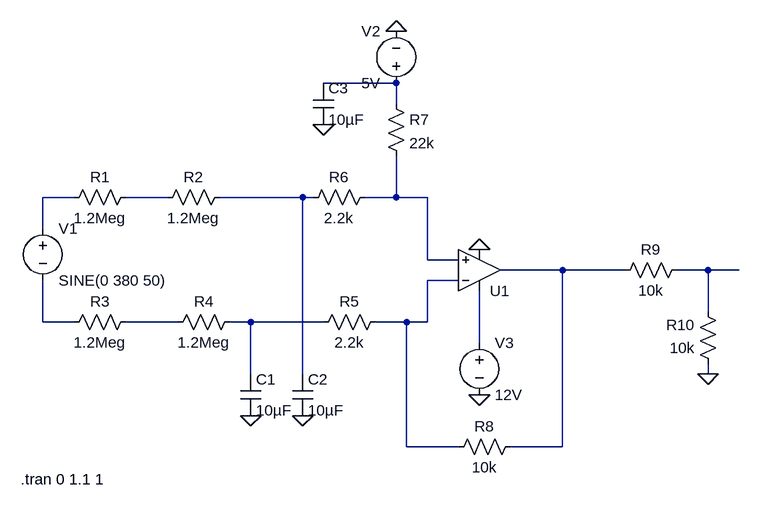
[diagram p0: schematic LT_Simulation_1st_Attempt.asc]
LT_Simulation_1st_Attempt.asc, the LTspice schematic file:
Version 4
SHEET 1 1140 680
WIRE 608 -128 496 -128
WIRE 608 -96 608 -128
WIRE 112 48 64 48
WIRE 256 48 192 48
WIRE 464 48 336 48
WIRE 480 48 464 48
WIRE 608 48 608 -16
WIRE 608 48 560 48
WIRE 656 48 608 48
WIRE 64 96 64 48
WIRE 656 144 656 48
WIRE 704 144 656 144
WIRE 864 160 768 160
WIRE 960 160 864 160
WIRE 1088 160 1040 160
WIRE 1136 160 1088 160
WIRE 704 176 656 176
WIRE 1088 224 1088 160
WIRE 64 240 64 176
WIRE 112 240 64 240
WIRE 272 240 192 240
WIRE 384 240 352 240
WIRE 496 240 384 240
WIRE 624 240 576 240
WIRE 656 240 656 176
WIRE 656 240 624 240
WIRE 736 272 736 192
WIRE 384 320 384 240
WIRE 464 320 464 48
WIRE 1088 320 1088 304
WIRE 624 432 624 240
WIRE 704 432 624 432
WIRE 864 432 864 160
WIRE 864 432 784 432
FLAG 496 -64 0
FLAG 384 384 0
FLAG 464 384 0
FLAG 608 -208 0
FLAG 736 128 0
FLAG 736 352 0
FLAG 1088 320 0
SYMBOL voltage 64 80 R0
WINDOW 123 0 0 Left 2
WINDOW 39 0 0 Left 2
SYMATTR InstName V1
SYMATTR Value SINE(0 380 50)
SYMBOL res 208 32 R90
WINDOW 0 0 56 VBottom 2
WINDOW 3 32 56 VTop 2
SYMATTR InstName R1
SYMATTR Value 1.2Meg
SYMBOL res 352 32 R90
WINDOW 0 0 56 VBottom 2
WINDOW 3 32 56 VTop 2
SYMATTR InstName R2
SYMATTR Value 1.2Meg
SYMBOL res 208 224 R90
WINDOW 0 0 56 VBottom 2
WINDOW 3 32 56 VTop 2
SYMATTR InstName R3
SYMATTR Value 1.2Meg
SYMBOL res 368 224 R90
WINDOW 0 0 56 VBottom 2
WINDOW 3 32 56 VTop 2
SYMATTR InstName R4
SYMATTR Value 1.2Meg
SYMBOL res 592 224 R90
WINDOW 0 0 56 VBottom 2
WINDOW 3 32 56 VTop 2
SYMATTR InstName R5
SYMATTR Value 2.2k
SYMBOL res 576 32 R90
WINDOW 0 0 56 VBottom 2
WINDOW 3 32 56 VTop 2
SYMATTR InstName R6
SYMATTR Value 2.2k
SYMBOL cap 368 320 R0
SYMATTR InstName C1
SYMATTR Value 10µF
SYMBOL cap 448 320 R0
SYMATTR InstName C2
SYMATTR Value 10µF
SYMBOL res 592 -112 R0
SYMATTR InstName R7
SYMATTR Value 22k
SYMBOL cap 480 -128 R0
SYMATTR InstName C3
SYMATTR Value 10µF
SYMBOL voltage 608 -112 R180
WINDOW 0 24 96 Left 2
WINDOW 3 24 16 Left 2
WINDOW 123 0 0 Left 2
WINDOW 39 0 0 Left 2
SYMATTR InstName V2
SYMATTR Value 5V
SYMBOL Opamps\\UniversalOpamp2 736 160 M180
SYMATTR InstName U1
SYMBOL voltage 736 256 R0
WINDOW 123 0 0 Left 2
WINDOW 39 0 0 Left 2
SYMATTR InstName V3
SYMATTR Value 12V
SYMBOL res 800 416 R90
WINDOW 0 0 56 VBottom 2
WINDOW 3 32 56 VTop 2
SYMATTR InstName R8
SYMATTR Value 10k
SYMBOL res 1056 144 R90
WINDOW 0 0 56 VBottom 2
WINDOW 3 32 56 VTop 2
SYMATTR InstName R9
SYMATTR Value 10k
SYMBOL res 1104 320 R180
WINDOW 0 36 76 Left 2
WINDOW 3 36 40 Left 2
SYMATTR InstName R10
SYMATTR Value 10k
TEXT 30 482 Left 2 !.tran 0 1.1 1

The netlist it stands for:
* LT_Simulation_1st_Attempt.asc
V1 N002 N009 SINE(0 380 50)
R1 N003 N002 1.2Meg
R2 N004 N003 1.2Meg
R3 N010 N009 1.2Meg
R4 N011 N010 1.2Meg
R5 N008 N011 2.2k
R6 N005 N004 2.2k
C1 N011 0 10µF
C2 N004 0 10µF
R7 N001 N005 22k
C3 N001 0 10µF
V2 N001 0 5V
XU1 N005 N008 N012 0 N006 level.2 Avol=1Meg GBW=10Meg Slew=10Meg ilimit=25m rail=0 Vos=0 phimargin=45 en=0 enk=0 in=0 ink=0 Rin=500Meg  ; pins IN+ IN- V+ V- OUT
V3 N012 0 12V
R8 N006 N008 10k
R9 N007 N006 10k
R10 0 N007 10k
.tran 0 1.1 1
.lib UniversalOpamps2.sub
.backanno
.end